# EAGLE design diskohedron4w_revc_autoroute (EAGLE 6.5.0)
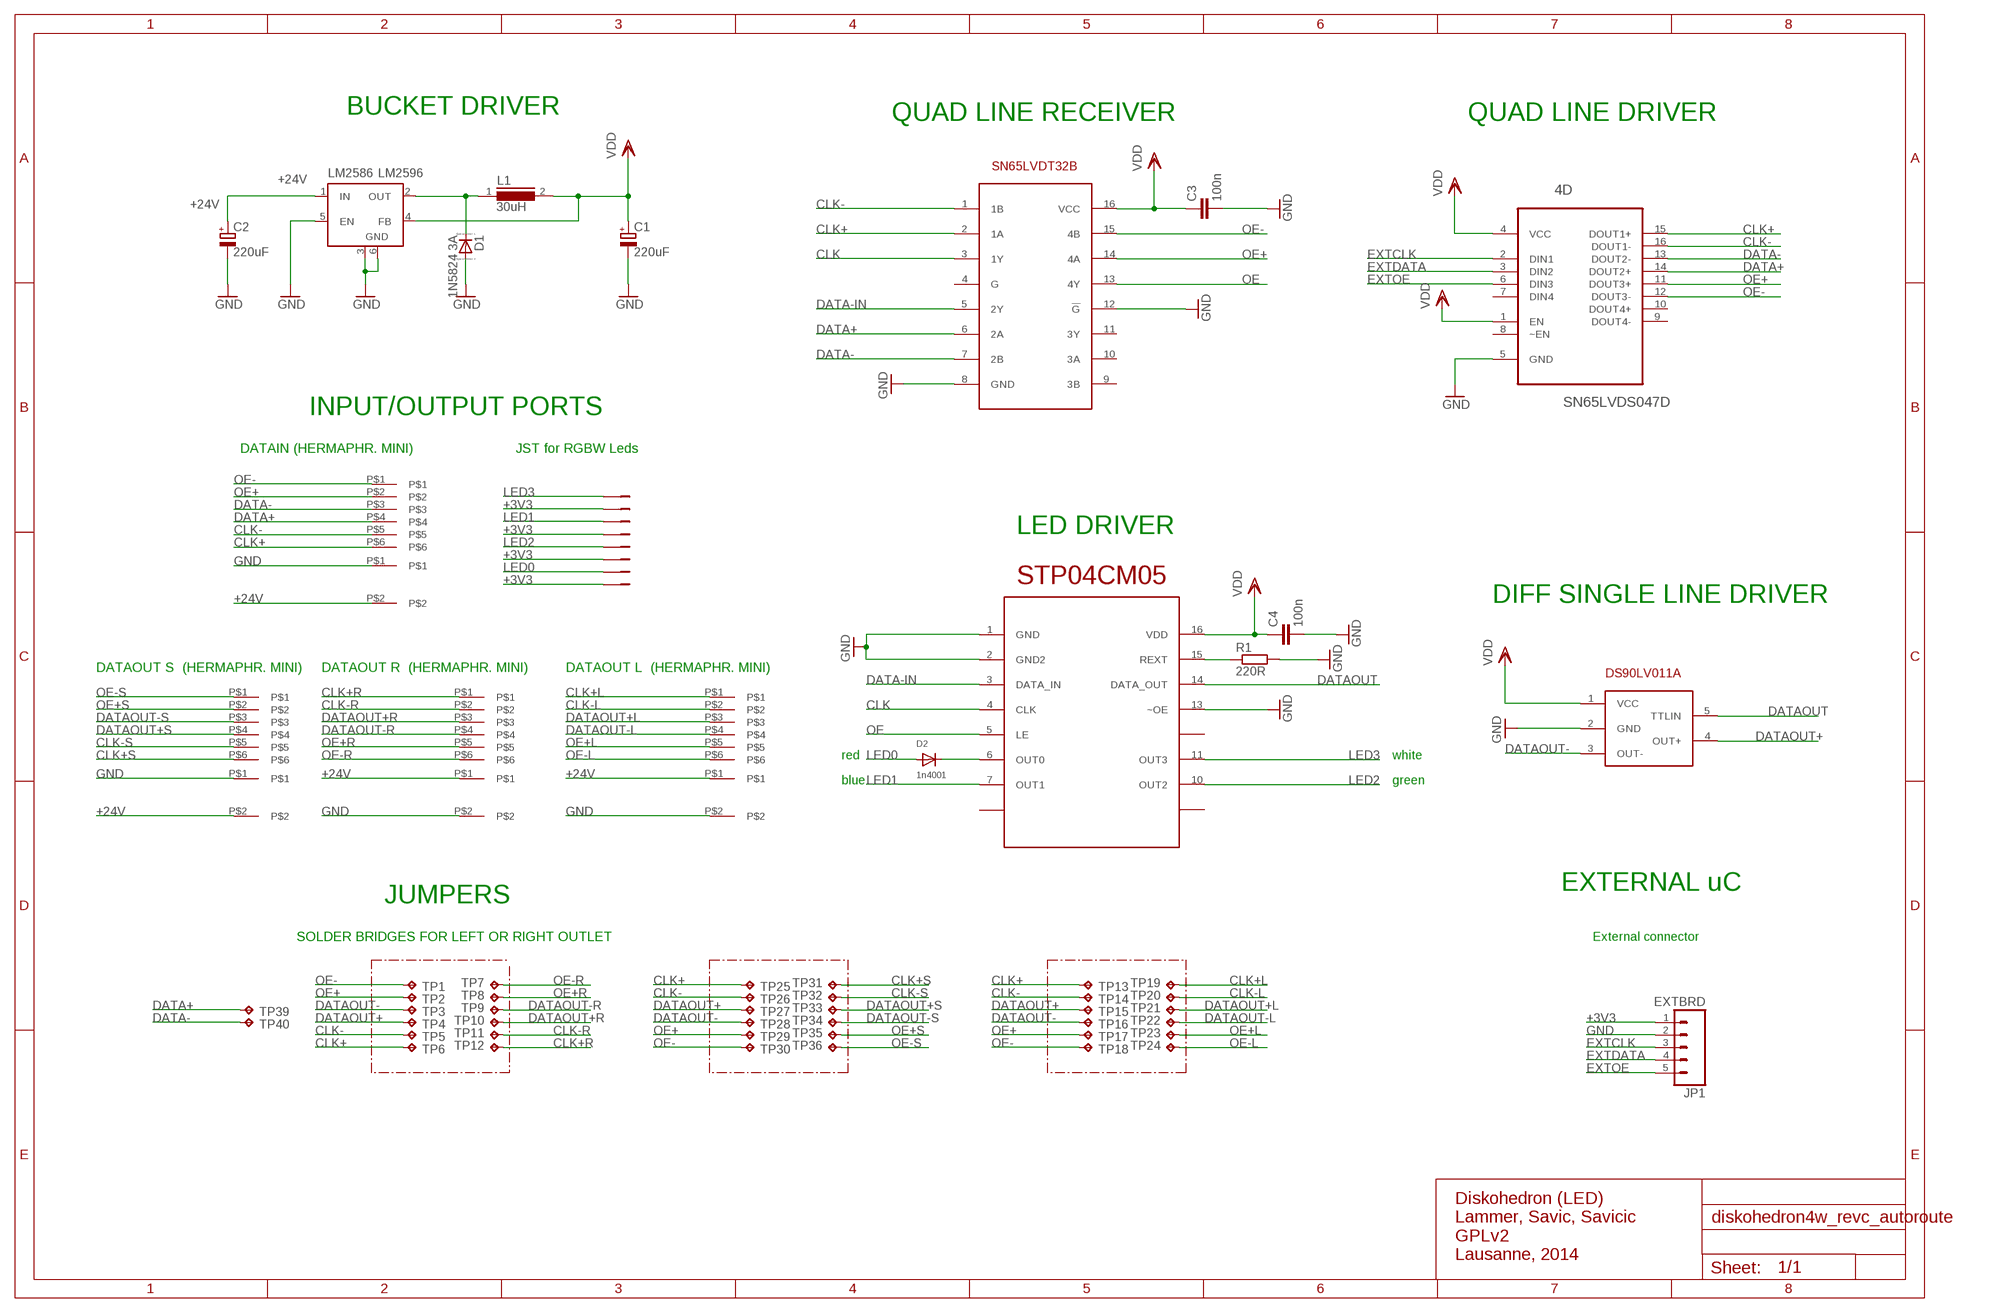
[diagram p0: schematic, sheet 1]

## Parts
1D  DS90LV011A  [SOT23-5]
4D  SN65LVDS047D  [SOIC127P600X175-16N]
4R  SN65LVDST32  [SOIC16]
C1  220uF  CPOL-EU175TMP-0810  [175TMP-0810]
C2  220uF  CPOL-EU175TMP-0810  [175TMP-0810]
C3  100n  C-EUC0805  [C0805]
C4  100n  C-EUC0805  [C0805]
D1  1N5824 3A  DIODE_E-SMC  [DIODE_SMC]
D2  1n4001  DIODESMA  [SMADIODE]
IN1  HERMAPHRODITMINI6PIN  [HERMAPHRODITMINI6PIN]
JP1  EXTBRD  M05PTH  [1X05]
JST  8PIN-ZH  [B8B-ZH]
L1  30uH  DR127  [DR127]
LM2586  LM2596  LM2596S  [TO263-5]
OUT-L  HERMAPHRODITMINI6PIN  [HERMAPHRODITMINI6PIN]
OUT-R  HERMAPHRODITMINI6PIN  [HERMAPHRODITMINI6PIN]
OUT-R1  HERMAPHRODITMINI6PIN  [HERMAPHRODITMINI6PIN]
R1  220R  R-EU_M0805  [M0805]
STP04  STP04CM05  [TSSOP16]
TP1  TPTP12SQ  [TP12SQ]
TP2  TPTP12SQ  [TP12SQ]
TP3  TPTP09SQ  [TP09SQ]
TP4  TPTP09SQ  [TP09SQ]
TP5  TPTP12SQ  [TP12SQ]
TP6  TPTP12SQ  [TP12SQ]
TP7  TPTP12SQ  [TP12SQ]
TP8  TPTP12SQ  [TP12SQ]
TP9  TPTP19SQ  [TP19SQ]
TP10  TPTP19SQ  [TP19SQ]
TP11  TPTP12SQ  [TP12SQ]
TP12  TPTP12SQ  [TP12SQ]
TP13  TPTP12SQ  [TP12SQ]
TP14  TPTP12SQ  [TP12SQ]
TP15  TPTP12SQ  [TP12SQ]
TP16  TPTP12SQ  [TP12SQ]
TP17  TPTP12SQ  [TP12SQ]
TP18  TPTP12SQ  [TP12SQ]
TP19  TPTP12SQ  [TP12SQ]
TP20  TPTP12SQ  [TP12SQ]
TP21  TPTP12SQ  [TP12SQ]
TP22  TPTP12SQ  [TP12SQ]
TP23  TPTP12SQ  [TP12SQ]
TP24  TPTP12SQ  [TP12SQ]
TP25  TPTP12SQ  [TP12SQ]
TP26  TPTP12SQ  [TP12SQ]
TP27  TPTP12SQ  [TP12SQ]
TP28  TPTP12SQ  [TP12SQ]
TP29  TPTP12SQ  [TP12SQ]
TP30  TPTP12SQ  [TP12SQ]
TP31  TPTP12SQ  [TP12SQ]
TP32  TPTP12SQ  [TP12SQ]
TP33  TPTP12SQ  [TP12SQ]
TP34  TPTP12SQ  [TP12SQ]
TP35  TPTP12SQ  [TP12SQ]
TP36  TPTP12SQ  [TP12SQ]
TP39  TPTP09SQ  [TP09SQ]
TP40  TPTP09SQ  [TP09SQ]
U$1  HERMAPHRODIT2PIN  [HERMAPHRODIT2PIN]
U$6  HERMAPHRODIT2PIN  [HERMAPHRODIT2PIN]
U$7  HERMAPHRODIT2PIN  [HERMAPHRODIT2PIN]
U$12  HERMAPHRODIT2PIN  [HERMAPHRODIT2PIN]

## Nets
+3V3: 1D.1(VCC) 4D.1(EN) 4D.4(VCC) 4R.16(VCC) C1.+ C3.1 C4.1 JP1.1 JST.2 JST.4 JST.6 JST.8 L1.2 LM2586.4(FB) STP04.16(VDD) ; supply symbol labelled VDD
+24V: C2.+ LM2586.1(IN) U$1.P$2 U$6.P$1 U$7.P$2 U$12.P$1
CLK: 4R.3(1Y) STP04.4(CLK)
CLK+: 4D.15(DOUT1+) 4R.2(1A) IN1.P$6 TP6.TP TP13.TP TP25.TP
CLK+L: OUT-L.P$1 TP19.TP
CLK+R: OUT-R.P$1 TP12.TP
CLK+S: OUT-R1.P$6 TP31.TP
CLK-: 4D.16(DOUT1-) 4R.1(1B) IN1.P$5 TP5.TP TP14.TP TP26.TP
CLK-L: OUT-L.P$2 TP20.TP
CLK-R: OUT-R.P$2 TP11.TP
CLK-S: OUT-R1.P$5 TP32.TP
DATA+: 4D.14(DOUT2+) 4R.6(2A) IN1.P$4 TP39.TP
DATA-: 4D.13(DOUT2-) 4R.7(2B) IN1.P$3 TP40.TP
DATA-IN: 4R.5(2Y) STP04.3(DATA_IN)
DATAOUT: 1D.5(TTLIN) STP04.14(DATA_OUT)
DATAOUT+: 1D.4(OUT+) TP4.TP TP15.TP TP27.TP
DATAOUT+L: OUT-L.P$3 TP21.TP
DATAOUT+R: OUT-R.P$3 TP10.TP
DATAOUT+S: OUT-R1.P$4 TP33.TP
DATAOUT-: 1D.3(OUT-) TP3.TP TP16.TP TP28.TP
DATAOUT-L: OUT-L.P$4 TP22.TP
DATAOUT-R: OUT-R.P$4 TP9.TP
DATAOUT-S: OUT-R1.P$3 TP34.TP
EXTCLK: 4D.2(DIN1) JP1.3
EXTDATA: 4D.3(DIN2) JP1.4
EXTOE: 4D.6(DIN3) JP1.5
GND: 1D.2(GND) 4D.5(GND) 4R.8(GND) 4R.12(!G) C1.- C2.- C3.2 C4.2 D1.A(C) JP1.2 LM2586.3(GND) LM2586.5(EN) LM2586.6(GND) R1.2 STP04.1(GND) STP04.2(GND2) STP04.13(~OE) U$1.P$1 U$6.P$2 U$7.P$1 U$12.P$2
LED0: D2.A JST.7
LED1: JST.3 STP04.7(OUT1)
LED2: JST.5 STP04.10(OUT2)
LED3: JST.1 STP04.11(OUT3)
N$1: R1.1 STP04.15(REXT)
N$2: D1.C(A) L1.1 LM2586.2(OUT)
N$3: D2.C STP04.6(OUT0)
OE: 4R.13(4Y) STP04.5(LE)
OE+: 4D.11(DOUT3+) 4R.14(4A) IN1.P$2 TP2.TP TP17.TP TP29.TP
OE+L: OUT-L.P$5 TP23.TP
OE+R: OUT-R.P$5 TP8.TP
OE+S: OUT-R1.P$2 TP35.TP
OE-: 4D.12(DOUT3-) 4R.15(4B) IN1.P$1 TP1.TP TP18.TP TP30.TP
OE-L: OUT-L.P$6 TP24.TP
OE-R: OUT-R.P$6 TP7.TP
OE-S: OUT-R1.P$1 TP36.TP
Unconnected: 4D.7(DIN4) 4D.8(~EN) 4D.9(DOUT4-) 4D.10(DOUT4+) 4R.4(G) 4R.9(3B) 4R.10(3A) 4R.11(3Y) STP04.8(N.C1) STP04.9(NC) STP04.12(NC3)

## Notes on the sheet
- BUCKET DRIVER | QUAD LINE RECEIVER | QUAD LINE DRIVER
- INPUT/OUTPUT PORTS
- DATAIN (HERMAPHR. MINI) | JST for RGBW Leds
- LED DRIVER
- DIFF SINGLE LINE DRIVER
- DATAOUT S  (HERMAPHR. MINI) | DATAOUT R  (HERMAPHR. MINI) | DATAOUT L  (HERMAPHR. MINI)
- red | white
- blue | green
- EXTERNAL uC
- JUMPERS
- SOLDER BRIDGES FOR LEFT OR RIGHT OUTLET | External connector
- for Arduino, etc.
- not differentiated
- Diskohedron (LED)
  Lammer, Savic, Savicic
  GPLv2
  Lausanne, 2014

## Library data of the parts
1D = diskohedron:DS90LV011A: 3V LVDS Single High Speed Differential Driver
4D = Texas Instruments_By_element14_Batch_1:SN65LVDS047D: LVDS QUAD DIFFERENTIAL LINE DRIVER; MPN: SN65LVDS047D; OC_FARNELL: 8452350; OC_NEWARK: 75C7839; PACKAGE: SOIC-16; SUPPLIER: TEXAS INSTRUMENTS
4R = diskohedron:SN65LVDST32
C1 C2 = rcl:CPOL-EU: POLARIZED CAPACITOR, European symbol
C3 C4 = rcl:C-EU: CAPACITOR, European symbol
D1 = eagle-ltspice:DIODE_E-: Schottky Diode; SPICEMODEL: diode; SPICEPREFIX: D
D2 = adafruit:DIODE: Diode SMADIODE - SMA Surface Mount Package 20V 1A Schottky Diode Digikey: 641-1014-6-ND DO-1N4148 - Through Hole Small Current Diode SOD-123 20V 1 A (.5mV Vf) Schottky Diode - Digikey: MBRX120TPMSCT-ND SOD-323 10V 570mA (.38mV Vf, 3ns) Schottky Diode - Digikey: ZLLS410CT-ND SOD-523 30V 30mA Schottky Diode (RB751S-40TE61) - Digikey: RB751S-40TE61CT-ND SOT23-R/W - SOT23 Package (R = Solder Paste/Reflow Ovens, W = Hand-Soldering) BAT54Film 40V 300mA - Digikey: 497-7162-1-ND
IN1 OUT-L OUT-R OUT-R1 = diskohedron:HERMAPHRODITMINI6PIN: MINIATURE HERMAPHRODITIC (6P) 1971567-3 TE Internal Number: 1971567-3 http://www.te.com/catalog/bin/TE.Connect?S=29506&M=PPROP&P=&BML=&LG=1&PG=1&IDS=517146,517147,517148&N=3
JP1 = SparkFun-Connectors:M05: Header 5 Standard 5-pin 0.1" header. Use with straight break away headers (SKU : PRT-00116), right angle break away headers (PRT-00553), swiss pins (PRT-00743), machine pins (PRT-00117), and female headers (PRT-00115). Molex polarized connector foot print use with SKU : PRT-08230 with associated crimp pins and housings.
JST = diskohedron:8PIN-ZH
L1 = inductors:DR127: High Power Density, High Efficiency, Shielded Inductors Source: coiltronics_dr_series.pdf
LM2586 = linear:LM2596S: STEP-DOWN VOLTAGE REGULATOR
R1 = resistor:R-EU_: RESISTOR, European symbol
STP04 = stp04:STP04CM05
TP1-TP36 TP39 TP40 = testpad:TP: Test pad
U$1 U$6 U$7 U$12 = diskohedron:HERMAPHRODIT2PIN: Hermaphroditic Blade and Receptacle Connectors TE Internal Number: 1954289-1 http://www.te.com/catalog/pn/en/1954289-1?RQPN=1954289-1

## Board
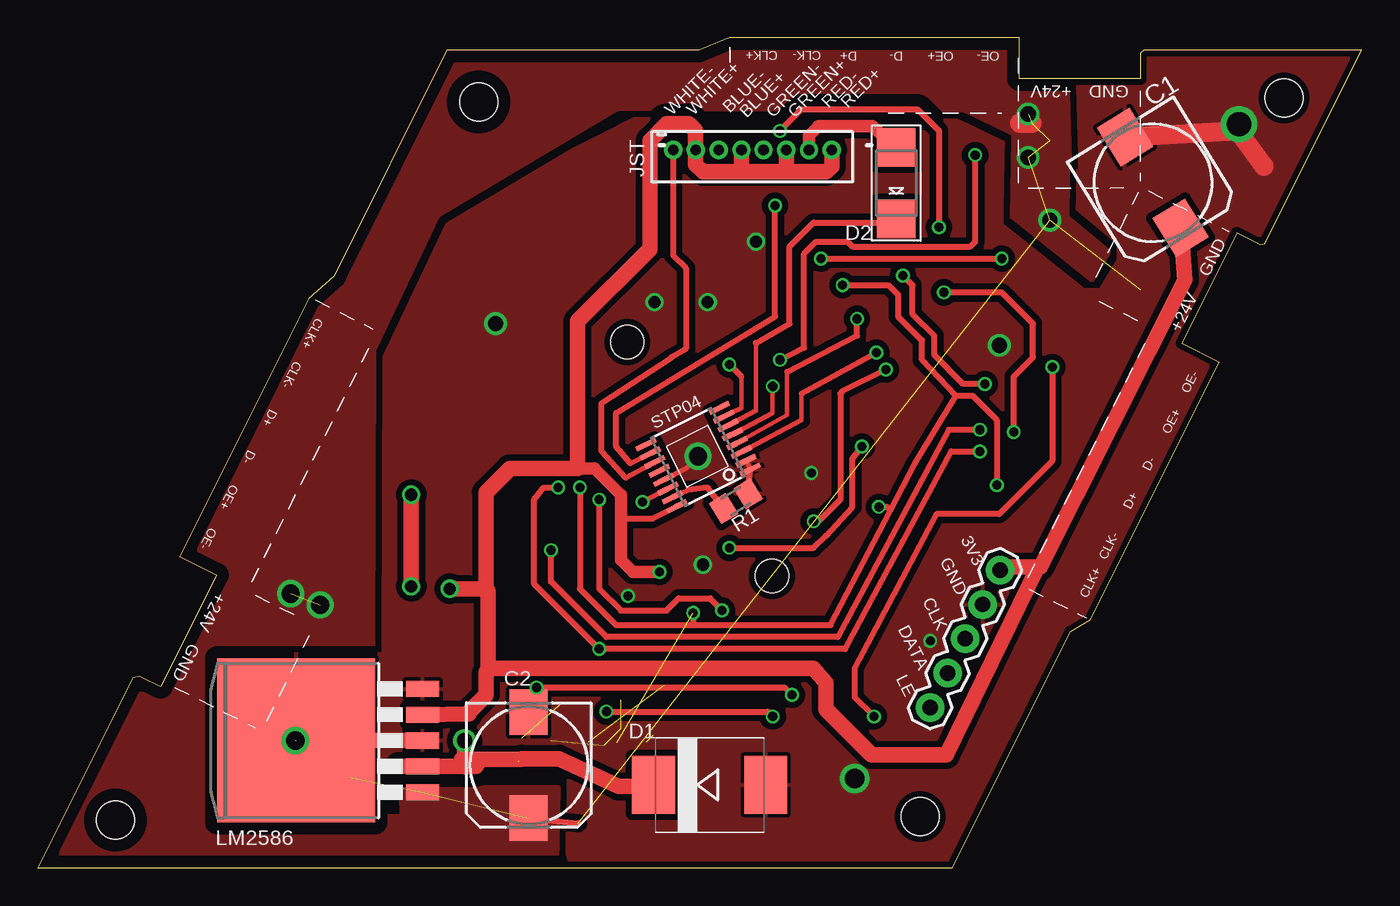
[diagram p1: board, top side]
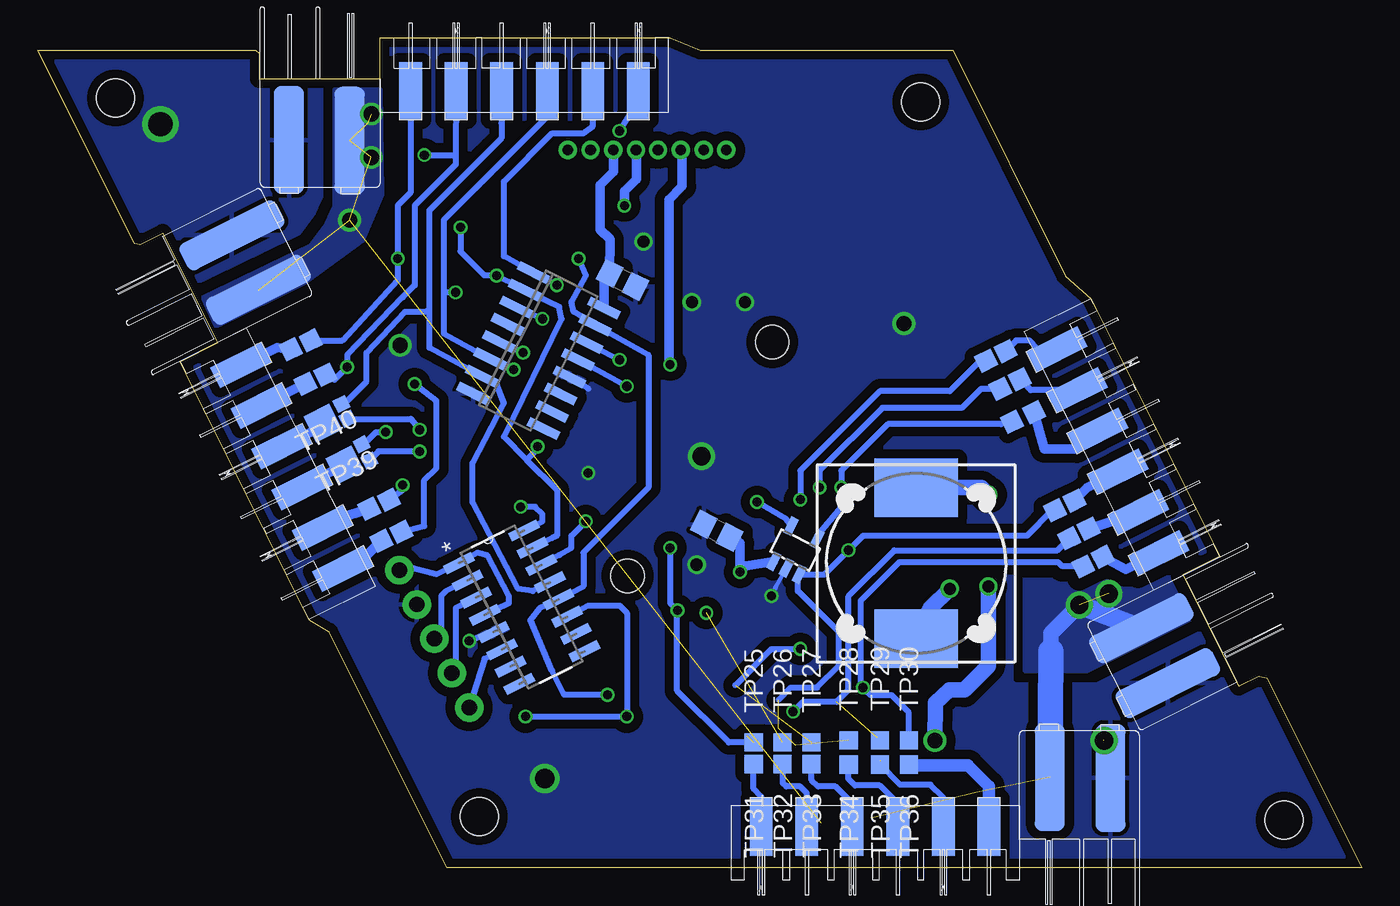
[diagram p2: board, bottom side, seen from below]

Size 87.17 x 54.68 mm. Coordinates in mm from the lower left corner, seen from the top.
Outline: 0,0 60.23,0 68,15.55 69.3,16.35 77.81,33.34 75.32,34.58 78.97,41.83 80.47,41.08 80.8,41.12 87.17,53.88 72.85,53.88 72.6,53.68 72.6,52 64.62,52 64.62,54.68 45.55,54.68 43.55,53.88 26.93,53.88 19.5,39 17.83,37.5 9.34,20.51 11.76,19.3 8.07,11.95 6.72,12.62 6.25,12.53 0,0
Copper layers (1*16): Top 0.035mm / dielectric 1.5mm / Bottom 0.035mm
Design rules "ITEADstudio_DRC": minimum track width 6mil, minimum drill 12mil, track to track 6mil, track to pad 6mil, pad to pad 6mil, via to via 6mil, smd to smd 0mil, copper to edge 10mil, drill to drill 10mil, minimum pad ring 10mil, minimum via ring 6mil, stop-mask expansion 2mil, vias tented up to drill 100mil, thermal gap 10mil
Holes 2.5 mm at 5.1,3.15 82.06,50.73 29.03,50.46 58.11,3.39
Holes 2.2 mm at 38.81,34.64 48.35,19.22
Milling: 25 lines

### Footprints (pad centres in the part's own frame; a part is rotated, then mirrored left to right if it is on the bottom)
SOT23-5 = smd 0.55 x 1.2: 1 -0.95,-1.3; 2 0,-1.3; 3 0.95,-1.3; 4 0.95,1.3; 5 -0.95,1.3
SOIC127P600X175-16N = smd 2.057 x 0.61: 1 -4.801,8.89; 2 -4.801,7.62; 3 -4.801,6.35; 4 -4.801,5.08; 5 -4.801,3.81; 6 -4.801,2.54; 7 -4.801,1.27; 8 -4.801,0; 9 0,0; 10 0,1.27; 11 0,2.54; 12 0,3.81; 13 0,5.08; 14 0,6.35; 15 0,7.62; 16 0,8.89
SOIC16 = smd 0.6 x 2.2: 1 -4.445,-2.6; 2 -3.175,-2.6; 3 -1.905,-2.6; 4 -0.635,-2.6; 5 0.635,-2.6; 6 1.905,-2.6; 7 3.175,-2.6; 8 4.445,-2.6; 9 4.445,2.6; 10 3.175,2.6; 11 1.905,2.6; 12 0.635,2.6; 13 -0.635,2.6; 14 -1.905,2.6; 15 -3.175,2.6; 16 -4.445,2.6
175TMP-0810 = smd 3 x 2.5: + 3.5,0; - -3.5,0
C0805 = smd 1.3 x 1.5: 1 -0.95,0; 2 0.95,0
DIODE_SMC = smd 2.8 x 3.8: A 3.7,0; C -3.7,0
SMADIODE = smd 2.54 x 2.54: A 2.349,0; C -2.349,0
HERMAPHRODITMINI6PIN = smd 1.5 x 3.8: P$1 1.996,1.406; P$2 4.997,1.406; P$3 7.997,1.406; P$4 10.997,1.406; P$5 13.997,1.406; P$6 16.997,1.406
1X05 = drill 1.016 pad 1.88: 1 0,0; 2 2.54,0; 3 5.08,0; 4 7.62,0; 5 10.16,0
B8B-ZH = drill 0.7 pad 1.1: 1 -2.25,0; 2 -0.75,0; 3 0.75,0; 4 2.25,0; 5 3.7,0; 6 5.2,0; 7 6.7,0; 8 8.2,0
DR127 = smd 3.85 x 5.5: 1 -4.975,0; 2 4.975,0
TO263-5 = smd 1.067 x 2.159: 1 -3.404,-5.791; 2 -1.702,-5.791; 3 0,-5.791; 4 1.702,-5.791; 5 3.404,-5.791 | smd 10.8 x 10.41: 6 0,2.54
M0805 = smd 1.3 x 1.6: 1 -0.95,0; 2 0.95,0
TSSOP16 = smd 0.35 x 1.43: 1 -2.275,-2.7; 2 -1.625,-2.7; 3 -0.975,-2.7; 4 -0.325,-2.7; 5 0.325,-2.7; 6 0.975,-2.7; 7 1.625,-2.7; 8 2.275,-2.7; 9 2.275,2.7; 10 1.625,2.7; 11 0.975,2.7; 12 0.325,2.7; 13 -0.325,2.7; 14 -0.975,2.7; 15 -1.625,2.7; 16 -2.275,2.7
TP12SQ = smd 1.2 x 1.2: TP 0,0
TP09SQ = smd 0.9 x 0.9: TP 0,0
TP19SQ = smd 1.9 x 1.9: TP 0,0
HERMAPHRODIT2PIN = smd 2 x 7.1: P$1 1.9,3.5; P$2 5.9,3.45

### Placement (x,y rotation side)
1D  37.29,20.93 333.4 bottom
4D  51.18,14.28 26.6 bottom
4R  54.22,34.07 243.4 bottom
C1  73.43,45.15 301.5 top
C2  32.32,6.78 270 top
C3  48.68,38.73 333.4 bottom
C4  42.47,22.22 153.4 bottom
D1  44.24,5.47 0 top
D2  56.53,45.11 90 top
IN1  64.63,49.78 0 bottom
JP1  63.38,19.62 243 top
JST  44.08,47.29 0 top
L1  29.34,20.07 270 bottom
LM2586  19.55,8.39 90 top
OUT-L  22.23,35.32 296.6 bottom
OUT-R  64.93,18.56 116.6 bottom
OUT-R1  22.54,4.11 180 bottom
R1  45.96,24.16 31.5 top
STP04  43.48,27.07 116.6 top
TP1  69.21,34.75 206.6 bottom
TP2  68.24,32.48 206.6 bottom
TP3  66.79,29.58 206.6 bottom
TP4  65.34,26.84 206.6 bottom
TP5  64.05,24.25 206.6 bottom
TP6  63.24,22.14 206.6 bottom
TP7  70.52,34.16 206.6 bottom
TP8  69.55,31.89 206.6 bottom
TP9  68.42,29.31 206.6 bottom
TP10  66.97,26.56 206.6 bottom
TP11  65.36,23.66 206.6 bottom
TP12  64.54,21.55 206.6 bottom
TP13  24.72,33.41 26.6 bottom
TP14  23.79,31.56 26.6 bottom
TP15  23.02,29.39 26.6 bottom
TP16  20.19,23.57 26.6 bottom
TP17  19.26,21.71 26.6 bottom
TP18  18.33,19.86 26.6 bottom
TP19  23.43,34.04 26.6 bottom
TP20  22.51,32.19 26.6 bottom
TP21  21.58,30.02 26.6 bottom
TP22  18.9,24.2 26.6 bottom
TP23  17.97,22.34 26.6 bottom
TP24  17.04,20.49 26.6 bottom
TP25  40.04,8.27 90 bottom
TP26  38.13,8.27 90 bottom
TP27  36.23,8.27 90 bottom
TP28  33.78,8.4 90 bottom
TP29  31.72,8.4 90 bottom
TP30  29.81,8.4 90 bottom
TP31  40.04,6.84 270 bottom
TP32  38.13,6.84 270 bottom
TP33  36.23,6.84 270 bottom
TP34  33.78,6.81 270 bottom
TP35  31.72,6.81 270 bottom
TP36  29.81,6.81 270 bottom
TP39  65.85,27.9 206.6 bottom
TP40  67.19,30.56 206.6 bottom
U$1  14.64,9.42 180 bottom
U$6  68.67,37.94 116.6 bottom
U$7  72.54,44.45 0 bottom
U$12  18.49,15.92 296.6 bottom

### Tracks (layer width: path | path; a pad name or v marks a point on that pad's centre or on a via)
+3V3  (via drill 0.6, 0.8)
  Top 0.406: STP04.16 40.46,22.99 38.71,22.99 38.39,22.68
  Top 0.61: 43.23,47.59 JST.2
  Top 0.813: 35.54,26.33 36.65,26.33 38.39,24.58 38.39,22.68 38.39,20.3 39.19,19.5 v40.93,19.5
  Top 1.016: C1.+ 75.54,38.71 66.02,19.82 65.86,19.82 | LM2586.4 28.39,10.13 28.39,10.29 29.5,11.4 29.5,12.83 29.66,13.15 | 29.5,18.39 29.5,24.74 31.09,26.33 35.54,26.33 35.54,36.01 40.3,40.77 40.3,47.92 41.41,49.03 42.84,49.03 43.31,48.55 43.31,47.31 JST.2 | 65.86,19.82 63.58,19.82 JP1.1 | 65.86,19.82 59.82,7.44 54.9,7.44 51.89,10.45 51.89,12.2 51.09,13.15 29.66,13.15 | JST.2 43.31,47.27 43.31,46.33 43.79,45.85 46.4,45.85 | 46.4,45.85 49.28,45.85 | 49.28,45.85 51.95,45.85 52.28,46.19 JST.8 | JST.8 | JST.4 46.33,45.92 46.4,45.85 | JST.6 49.28,45.86 49.28,45.85 | JST.2 | v27.12,18.39 29.5,18.39 | 29.66,13.15 29.66,18.23 29.5,18.39
  Bottom 0.406: 4D.4 56.17,17.44 56.17,17.91 57.6,20.61 58.24,20.77 4D.1 60.94,19.34 62.84,19.82 | 41.09,21.57 C4.1
  Bottom 0.61: 4R.16 49.9,38.78 C3.1 49.51,41.41 50.14,42.04 50.14,44.99 49.28,45.85 JST.6 | 1D.1 40.55,19.88 v40.93,19.5 40.93,21.41 41.09,21.57 | 62.84,19.82 JP1.1
  Bottom 1.016: L1.2 28.39,17.12 v27.12,18.39
  Bottom 1.27: 29.5,13.98 L1.2
+24V  (via drill 1, 1.2, 1.2 pad 1.68)  (9 unrouted)
  Top 0.406: C2.+ 35.58,2.95
  Top 1.27: 64.67,49.08 65.47,49.08
  Bottom 1.016: 20.45,14.26 20.45,15.46 v18.59,17.33
  Bottom 1.27: U$12.P$1 v18.59,17.33
  Bottom 1.676: U$1.P$2 20.45,14.26
  other vias: 65.22,49.66 66.65,42.68 16.64,18.07 65.22,46.81
  pour Top (isolate 0.813): 67.77,53.38 67.97,46.52 61.08,49.85 38.18,49.98 26.33,42.94 22.13,34.13 22.07,14.76 21.04,3.5 29.58,3.38 29.18,0.73 0.08,0.53 6.47,12.38 7.07,12.57 10.78,19.98 8.67,21.08 16.88,37.88 19.98,38.88 27.08,53.58 43.88,53.58 45.77,54.62 64.47,54.62 64.47,53.38
  pour Top (isolate 0.813, no thermals): 23.93,5.38 34.3,5.3 34.2,0.27 23.98,0.51
  pour Bottom (no thermals): 67.62,51.27 67.62,45.38 67.64,43.58 68.12,42.49 69.26,40.95 76.29,37.58 75.44,35.68 69.47,38.62 65.82,41.3 64.5,44.39 64.6,51.26
  pour Top (isolate 0.813): 64.26,51.35 64.1,42.9 69.4,38.68 70.58,40.59 67.82,42.87 67.88,45.38 67.88,50.98
  pour Bottom (isolate 0.813, no thermals): 12.36,19.98 15.53,18.71 16.8,19.5 22.2,19.34 22.2,12.99 18.07,12.99 11.09,16.49
CLK  (via drill 0.6)
  Top 0.305: STP04.4 49.35,29.82 49.35,32.68
  Top 0.406: 49.35,32.68 53.95,35.06 v53.95,36.17
  Bottom 0.406: v53.95,36.17 4R.3
CLK+  (via drill 0.6, 0.6 pad 0.61)  (1 unrouted)
  Top 0.406: v54.27,27.76 53.63,26.96 53.63,23.79 51.89,21.88 51.09,21.09 v45.54,21.09 | v48.87,48.55 50.3,49.98 57.92,49.98 59.35,48.55 v59.35,42.2 | v62.36,31.88 60.94,31.88 59.03,33.79 59.03,35.06 57.6,36.49 57.6,38.39 v56.97,39.03 | v36.96,24.26 36.96,18.39 38.39,16.96 41.41,16.96 42.2,17.76 44.27,17.76 v45.06,16.96
  Bottom 0.406: IN1.P$6 47.54,51.09 47.54,50.72 v48.87,48.55 | 54.98,26.88 53,24.9 53,21.88 53.32,21.72 4D.15 | 54.98,26.88 56.49,28.39 52.68,36.17 52.84,36.96 4R.2 55.57,38.32 | TP6.TP 61.73,22.52 61.73,25.53 60.94,26.33 60.94,30.77 v62.36,31.88 | 56.01,38.55 55.57,38.32 | v54.27,27.76 54.27,27.6 54.98,26.88 | TP13.TP 25.12,33.41 27.12,31.41 31.73,31.41 36.96,26.17 v36.96,24.26 | v59.35,42.2 59.35,40.62 57.76,39.03 v56.97,39.03 55.57,38.32 | v45.54,21.09 45.54,17.44 v45.06,16.96 45.08,16.95 45.08,11.67 41.67,8.27 TP25.TP
CLK+L
  Bottom 0.406: OUT-L.P$1 21.3,34.16 21.88,34.74 22.74,34.74 TP19.TP
CLK+R
  Bottom 0.406: 65.86,20.3 OUT-R.P$1
  Bottom 0.61: TP12.TP 65.86,20.3
CLK+S
  Bottom 0.406: OUT-R1.P$6 39.54,4.7 40.04,5.2 TP31.TP
CLK-  (via drill 0.6, 0.6 pad 0.61)  (1 unrouted)
  Top 0.406: 43.16,16.01 38.08,16.01 35.69,18.39 v35.69,25.06 | 43.16,16.01 52.2,16.01 56.15,23.55 | 56.15,23.55 57.76,26.65 60.46,31.09 | v63.16,25.22 63.16,29.5 61.57,31.09 60.46,31.09 | v53,38.39 56.01,38.39 56.65,37.76 56.65,36.33 58.24,34.74 58.24,33.47 60.46,31.09 | v43.16,16.8 43.16,16.01 | v55.38,23.79 55.91,23.79 56.15,23.55
  Bottom 0.406: IN1.P$5 50.63,50.14 50.62,50.12 50.62,48.87 51.25,48.39 53.32,48.39 56.49,45.22 56.49,40.3 4R.1 v53,38.39 | TP5.TP 63.17,24.89 v63.16,25.22 | 4D.16 53.95,22.84 53.95,23.31 54.43,23.79 v55.38,23.79 | TP14.TP 25.07,31.56 26.33,30.3 31.57,30.3 35.69,26.17 v35.69,25.06
CLK-L
  Bottom 0.406: 18,31.95 OUT-L.P$2 21.79,31.48 TP20.TP
CLK-R
  Bottom 0.406: 66.97,23.15 OUT-R.P$2
  Bottom 0.61: TP11.TP 66.97,23.15
CLK-S
  Bottom 0.406: OUT-R1.P$5 36.54,4.93 36.98,5.36 37.89,5.36 38.12,5.59 38.12,6.83 TP32.TP
DATA+  (via drill 0.6)
  Top 0.406: v55.86,32.84 53,31.41 52.84,31.25 52.84,24.26 51.41,22.84 v51.09,22.84 | v64.27,28.71 64.27,32.36 65.54,33.63 65.54,35.85 63.48,37.92 v59.66,37.92
  Bottom 0.406: IN1.P$4 53.42,50.26 | 53.42,50.26 53.32,49.82 53.32,49.51 | v55.86,32.84 4R.6 60.46,35.22 60.46,37.92 | 4D.14 52.84,20.61 52.05,21.09 52.05,21.88 v51.09,22.84 | 53.42,50.26 53.79,49.89 53.79,49.35 60.46,42.68 60.46,37.92 | TP39.TP 65.71,27.9 64.9,28.71 v64.27,28.71 | v59.66,37.92 60.46,37.92
DATA-
  Bottom 0.406: 4D.13 54.59,18.23 55.54,18.39 58.55,24.11 58.55,26.65 56.49,30.61 56.97,31.88 4R.7 61.41,34.27 61.41,36.8 | IN1.P$3 56.65,49.03 56.65,48.08 61.41,43.31 61.41,36.8 | TP40.TP 67.02,30.56 65.54,32.04 65.54,33.95 63,36.65 61.57,36.65 61.41,36.8
DATA-IN  (via drill 0.6)
  Top 0.305: STP04.3 50.3,29.5 50.3,31.25
  Top 0.406: 50.3,31.25 v55.22,33.95
  Bottom 0.406: v55.22,33.95 4R.5
DATAOUT  (via drill 0.6)
  Top 0.305: 39.88,24.14 v39.82,24.11 39.68,23.95 39.88,24.14 | 39.88,24.14 STP04.14
  Bottom 0.406: 1D.5 37.92,23 v39.82,24.11
DATAOUT+  (via drill 0.6)  (1 unrouted)
  Top 0.406: v62.05,27.44 60.14,27.44 53.16,14.42 v36.96,14.42 32.68,18.71 32.68,24.26 33.31,25.06 v34.27,25.06
  Bottom 0.406: TP15.TP 23.74,29.23 31.2,29.23 34.27,26.17 v34.27,25.06 34.27,23.79 35.86,21.87 1D.4 | v62.05,27.44 64.74,27.44 TP4.TP | v36.96,14.42 38.87,14.42 41.25,12.04
DATAOUT+L
  Bottom 0.61: OUT-L.P$3 17.51,28.8 18.71,27.6 20.9,27.6 TP21.TP
DATAOUT+R
  Bottom 0.61: TP10.TP OUT-R.P$3
DATAOUT+S
  Bottom 0.406: OUT-R1.P$4 33.54,4.24 34.66,5.36 35.8,5.36 36.22,5.78 TP33.TP
DATAOUT-  (via drill 0.6)  (3 unrouted)
  Top 0.406: v33.79,20.93 33.79,18.87 37.44,15.21 52.68,15.21 59.98,28.87 v62.05,28.87
  Bottom 0.406: TP16.TP 20.36,23.57 22.04,21.88 32.84,21.88 v33.79,20.93 | 33.79,20.77 v33.79,20.93 | v33.79,20.93 35.37,19.35 1D.3 37.12,19.25 37.12,18.23 34.42,15.53 34.42,13.31 35.85,11.88 37.6,11.88 38.39,11.09 | TP3.TP 62.6,29.58 v62.05,28.87
DATAOUT-L
  Bottom 0.61: TP22.TP 18.07,25.06 OUT-L.P$4
DATAOUT-R
  Bottom 0.61: TP9.TP 69.19,28.71 OUT-R.P$4
DATAOUT-S
  Bottom 0.406: OUT-R1.P$3 30.54,4.24 31.72,5.42 33.35,5.42 33.81,5.88 33.81,6.78 TP34.TP
EXTCLK
  Bottom 0.406: 4D.2 60.3,18.23 60.62,17.91 60.62,15.55 JP1.3
EXTDATA
  Bottom 0.406: 4D.3 59.35,17.28 59.66,17.12 59.66,13.08 JP1.4
EXTOE
  Bottom 0.406: 4D.6 57.76,13.79 JP1.5
GND  (via drill 0.6, 0.8, 1, 1.2, 1.2 pad 0.61, 1.3 pad 0.81, 1.6)  (1 unrouted)
  Top 0.305: STP04.2 STP04.1 | STP04.13 42.68,26.33 v43.47,27.12
  Top 0.406: C1.- 71.68,49.66 | R1.2 STP04.1
  Top 1.016: LM2586.3 LM2586.6
  Top 1.27: 80.75,46.21 79.04,48.56 C1.-
  Bottom 0.305: 1D.2 38.55,18.55 v38.87,17.91
  Bottom 0.406: 50.93,31.57 4R.12 | 4D.5 v58.77,14.95
  other vias: 79.1,48.99 53.8,5.89 50.93,26.01 63.32,34.42 40.62,37.28 44.11,37.28 30.14,35.85 47.28,41.25 43.79,19.98 16.96,8.39
  pour Top (isolate 0.406, rank 3): 35.4,-0.8 60.18,-1.02 68.47,14.88 72.07,15.78 80.47,32.48 78.77,34.18 81.77,40.58 84.38,44.68 88.88,54.68 72.77,54.48 71.57,54.98 68.27,55.08 68.06,45.53 65.07,50.27 39.77,49.58 26.48,42.88 15.88,22.08 15.24,20.88 12.02,14.8 11.87,6.38 26.28,6.47 33,6.93
  pour Bottom (isolate 0.61, rank 3): -0.43,-0.53 89.38,-0.53 89.38,56.58 -0.43,56.58
LED0
  Top 0.406: D2.A 55.55,47.3
  Top 0.813: JST.7 50.77,48.23 51.41,48.87 54.96,48.87 D2.A
LED1  (via drill 0.6)
  Top 0.305: STP04.7 46.33,30.3 46.33,32.36
  Top 0.406: v45.54,33.15 46.33,32.36
  Bottom 0.406: 45.63,33.25 v45.54,33.15
  Bottom 0.61: 45.63,33.25 45.63,44.02 44.74,44.9 44.74,47.2 JST.3
LED2  (via drill 0.6)
  Top 0.305: STP04.10 39.03,26.65
  Top 0.406: 39.03,26.65 38.08,27.76 38.08,29.98 48.55,36.33 v48.55,43.63
  Bottom 0.406: 47.76,47.42 JST.5
  Bottom 0.61: v48.55,43.63 48.55,44.58 47.76,45.38 47.76,47.42
LED3
  Top 0.305: STP04.11 38.71,25.69
  Top 0.406: 38.71,25.69 37.12,27.44 37.12,30.61 41.73,33.63 42.63,34.16 42.68,34.21 42.68,39.5 41.83,40.35 JST.1
N$1
  Top 0.305: 42.84,24.9 STP04.15
  Top 0.406: R1.1 44.11,25.06 42.84,24.9
N$2  (via drill 0.8, 1 pad 0.61)  (1 unrouted)
  Top 0.406: 29.03,6.85 28.87,6.69 | 23.75,6.7 29.24,6.7
  Top 1.016: 23.75,6.7 LM2586.2 28.87,6.69 27.91,7.14 | 27.91,7.14 31.81,7.14 | v24.58,24.58 v24.58,18.55 | v28.1,8.38 28.13,6.65 27.91,7.14 | 31.86,7.19 34.33,7.19 38.23,5.37 40.45,5.37 D1.C
  Bottom 0.406: 24.28,24.73 v24.58,24.58
  Bottom 1.016: v24.58,18.55 24.58,13.31 26.17,11.72 27.15,11.72 28.07,10.87 v28.1,8.38 | L1.1 25.05,25.05 v24.58,24.58
N$3
  Top 0.305: STP04.6 47.28,30.14 47.28,34.58
  Top 0.406: 47.28,34.58 49.51,35.85 49.51,40.93 51.09,42.52 56.3,42.52 D2.C
OE  (via drill 0.6)
  Top 0.305: STP04.5 48.39,29.98 v48.39,31.73
  Bottom 0.406: v48.39,31.73 4R.13
OE+  (via drill 0.6, 0.6 pad 0.61)  (1 unrouted)
  Top 0.406: v66.81,33 66.81,26.8 63.32,23.31 59.19,23.31 53.79,13.15 53.79,11.25 v55.06,9.98 | v37.44,10.29 48.08,10.29 v48.39,9.98 | v61.73,46.97 61.73,41.25 61.41,40.93 53.63,40.93 53.32,41.25 51.25,41.25 50.46,40.46 50.46,34.27 v48.87,33.47
  Bottom 0.406: 4R.14 v48.87,33.47 | IN1.P$2 59.66,46.96 | 59.66,46.96 59.66,46.33 62.36,43.63 62.36,38.39 63.16,37.6 66.81,33.79 v66.81,33 67.64,32.17 TP2.TP | v61.73,46.97 59.66,46.96 | TP17.TP 20.04,20.93 30.77,20.93 33.79,17.91 33.79,11.72 34.58,10.93 36.8,10.93 v37.44,10.29 | 31.87,8.56 TP29.TP | v55.06,9.98 v48.39,9.98 48.39,16.8 48.87,17.28 50.93,17.28 4D.11
OE+L
  Bottom 0.61: 14.87,23.49 OUT-L.P$5 TP23.TP
OE+R
  Bottom 0.61: TP8.TP OUT-R.P$5
OE+S
  Bottom 0.406: OUT-R1.P$2 27.54,4.64 28.39,5.49 30.4,5.49 TP35.TP
OE-  (via drill 0.6)
  Top 0.406: v49.66,11.4 49.19,11.88 v32.84,11.88 | v51.57,40.14 v63.48,40.14
  Bottom 0.406: v51.57,40.14 51.09,39.03 52.05,37.28 51.89,36.65 4R.15 46.97,33.79 46.97,25.06 51.25,20.77 51.25,18.55 4D.12 54.11,17.12 54.74,16.33 53.32,12.99 52.52,11.4 v49.66,11.4 | IN1.P$1 62.63,44.47 63.48,43.63 v63.48,40.14 63.48,38.71 67.12,34.75 TP1.TP | TP18.TP 19.7,19.86 19.98,20.14 30.46,20.14 33,17.6 33,12.04 v32.84,11.88 | 32.52,11.56 v32.84,11.88 | TP30.TP 29.81,10.24 30.94,11.37 32.32,11.37 v32.84,11.88
OE-L
  Bottom 0.61: TP24.TP 15.53,19.66 OUT-L.P$6
OE-R
  Bottom 0.61: TP7.TP 71.41,34.27 OUT-R.P$6
OE-S
  Bottom 0.813: OUT-R1.P$1 24.54,5.39 25.91,6.76 29.76,6.76 TP36.TP

### Text on the board
tPlace: +24V | GND | GND | +24V | +24V | GND
tNames: CLK+ | CLK- | D+ | D- | OE+ | OE- | WHITE- | WHITE+ | BLUE- | RED- | RED+ | BLUE+ | GREEN- | GREEN+ | CLK+ | CLK- | OE- | D+ | STP04 | OE+ | D- | D- | OE+ | D+ | OE- | 3V3 | CLK- | GND | CLK+ | CLK | DATA | LE
bSilk: INPUT | GND | +24V | GND | OUT-L | * | +24V | * | +24V | OUT-R | GND | SAVIC / LAMMER / SAVICIC | DISKO / HEDRON | rev.B | 06/2014
geo-helper: rotation angles: / 63.4 / 26.6